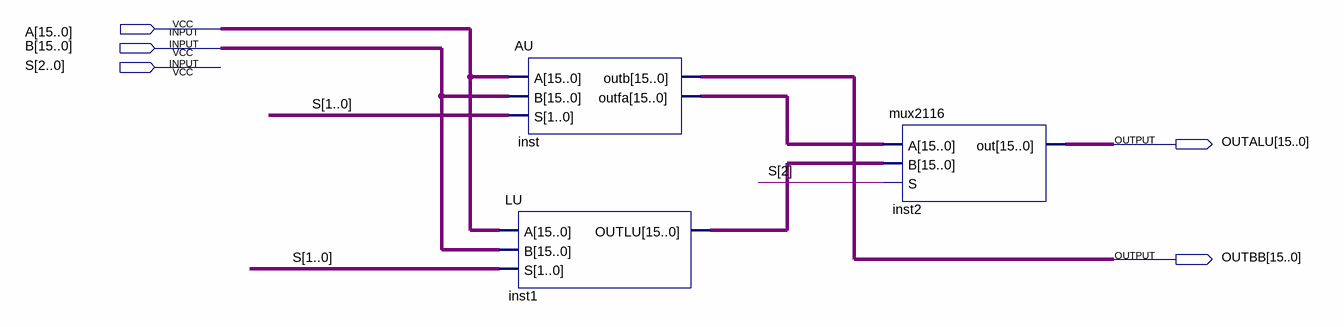
[diagram p0: schematic sheet]
// Quartus schematic ALU.bdf as structural Verilog: 3 symbols, 5 pins
module ALU (
  input  [15:0] A,
  input  [15:0] B,
  input  [2:0] S,
  output [15:0] OUTALU,
  output [15:0] OUTBB
);

  wire [15:0] inst1_outlu, inst_outfa;

  AU inst (.A(A), .B(B), .S(S[1:0]), .outb(OUTBB), .outfa(inst_outfa));
  LU inst1 (.A(A), .B(B), .S(S[1:0]), .OUTLU(inst1_outlu));
  mux2116 inst2 (.A(inst_outfa), .B(inst1_outlu), .S(S[2]), .out(OUTALU));
endmodule
